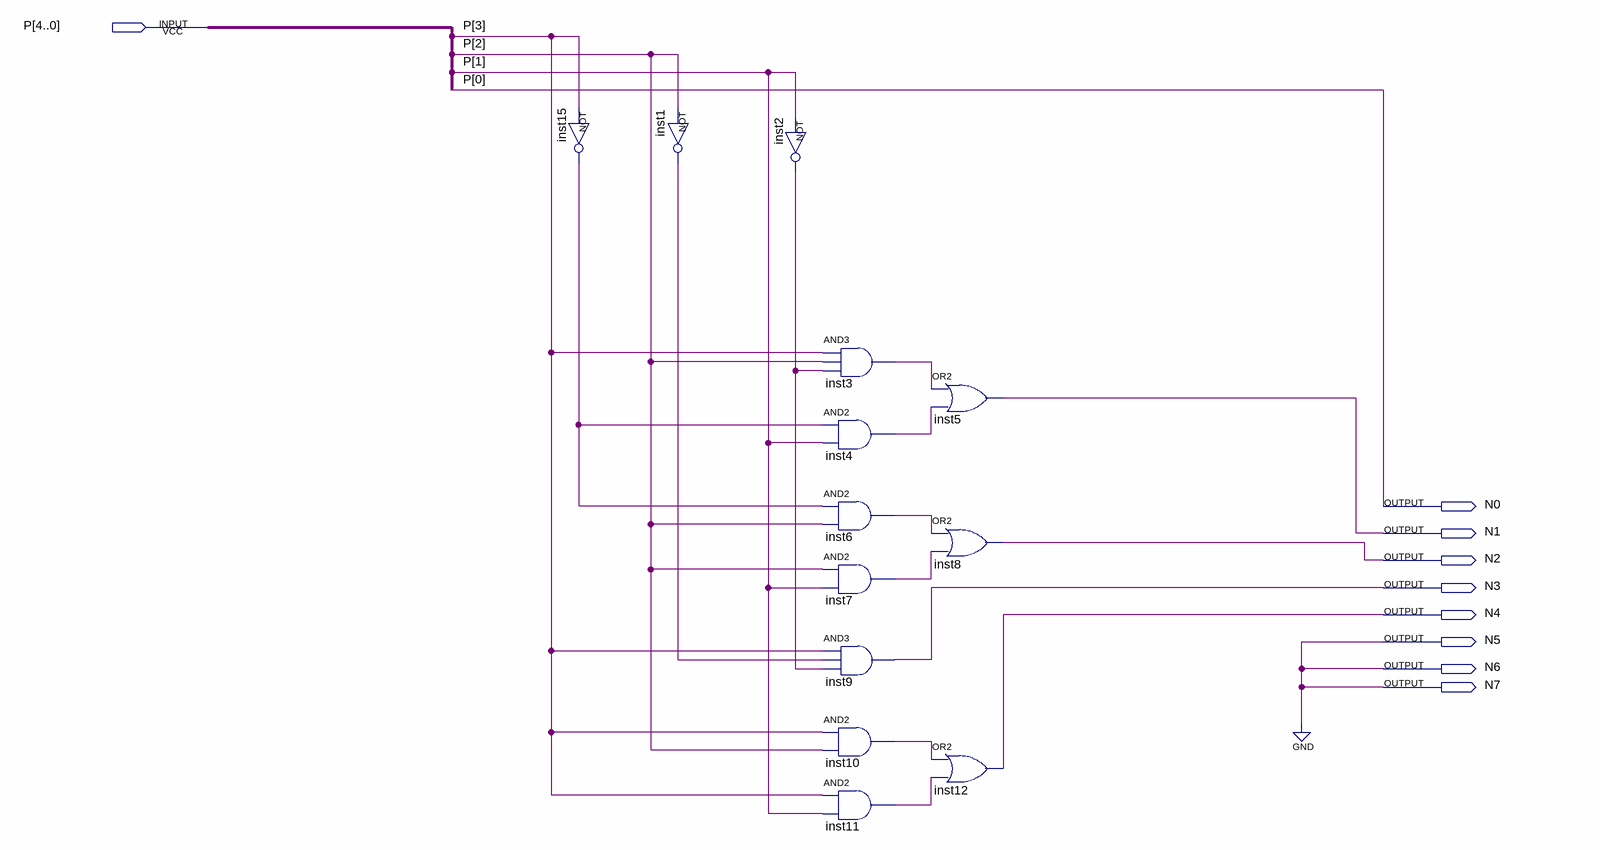
[diagram p0: schematic sheet]
// Quartus schematic binary2BDC.bdf as structural Verilog: 13 symbols, 9 pins
module binary2BDC (
  input  [4:0] P,
  output N0,
  output N1,
  output N2,
  output N3,
  output N4,
  output N5,
  output N6,
  output N7
);

  wire inst1_out, inst2_out, inst3_out, inst4_out, inst6_out, inst7_out, inst10_out, inst11_out, inst15_out;

  not inst15 (inst15_out, P[3]);
  not inst1 (inst1_out, P[2]);
  not inst2 (inst2_out, P[1]);
  and inst3 (inst3_out, P[3], P[2], inst2_out);
  and inst4 (inst4_out, inst15_out, P[1]);
  and inst6 (inst6_out, inst15_out, P[2]);
  and inst7 (inst7_out, P[2], P[1]);
  and inst9 (N3, P[3], inst1_out, inst2_out);
  and inst10 (inst10_out, P[3], P[2]);
  and inst11 (inst11_out, P[3], P[1]);
  or inst5 (N1, inst3_out, inst4_out);
  or inst8 (N2, inst6_out, inst7_out);
  or inst12 (N4, inst10_out, inst11_out);

  assign N0 = P[0];
  assign N5 = 1'b0;
  assign N6 = 1'b0;
  assign N7 = 1'b0;
endmodule
